# Altium schematic sheet external hvd schematic.SchDoc
size B; SheetNumber: 3; SheetTotal: 4
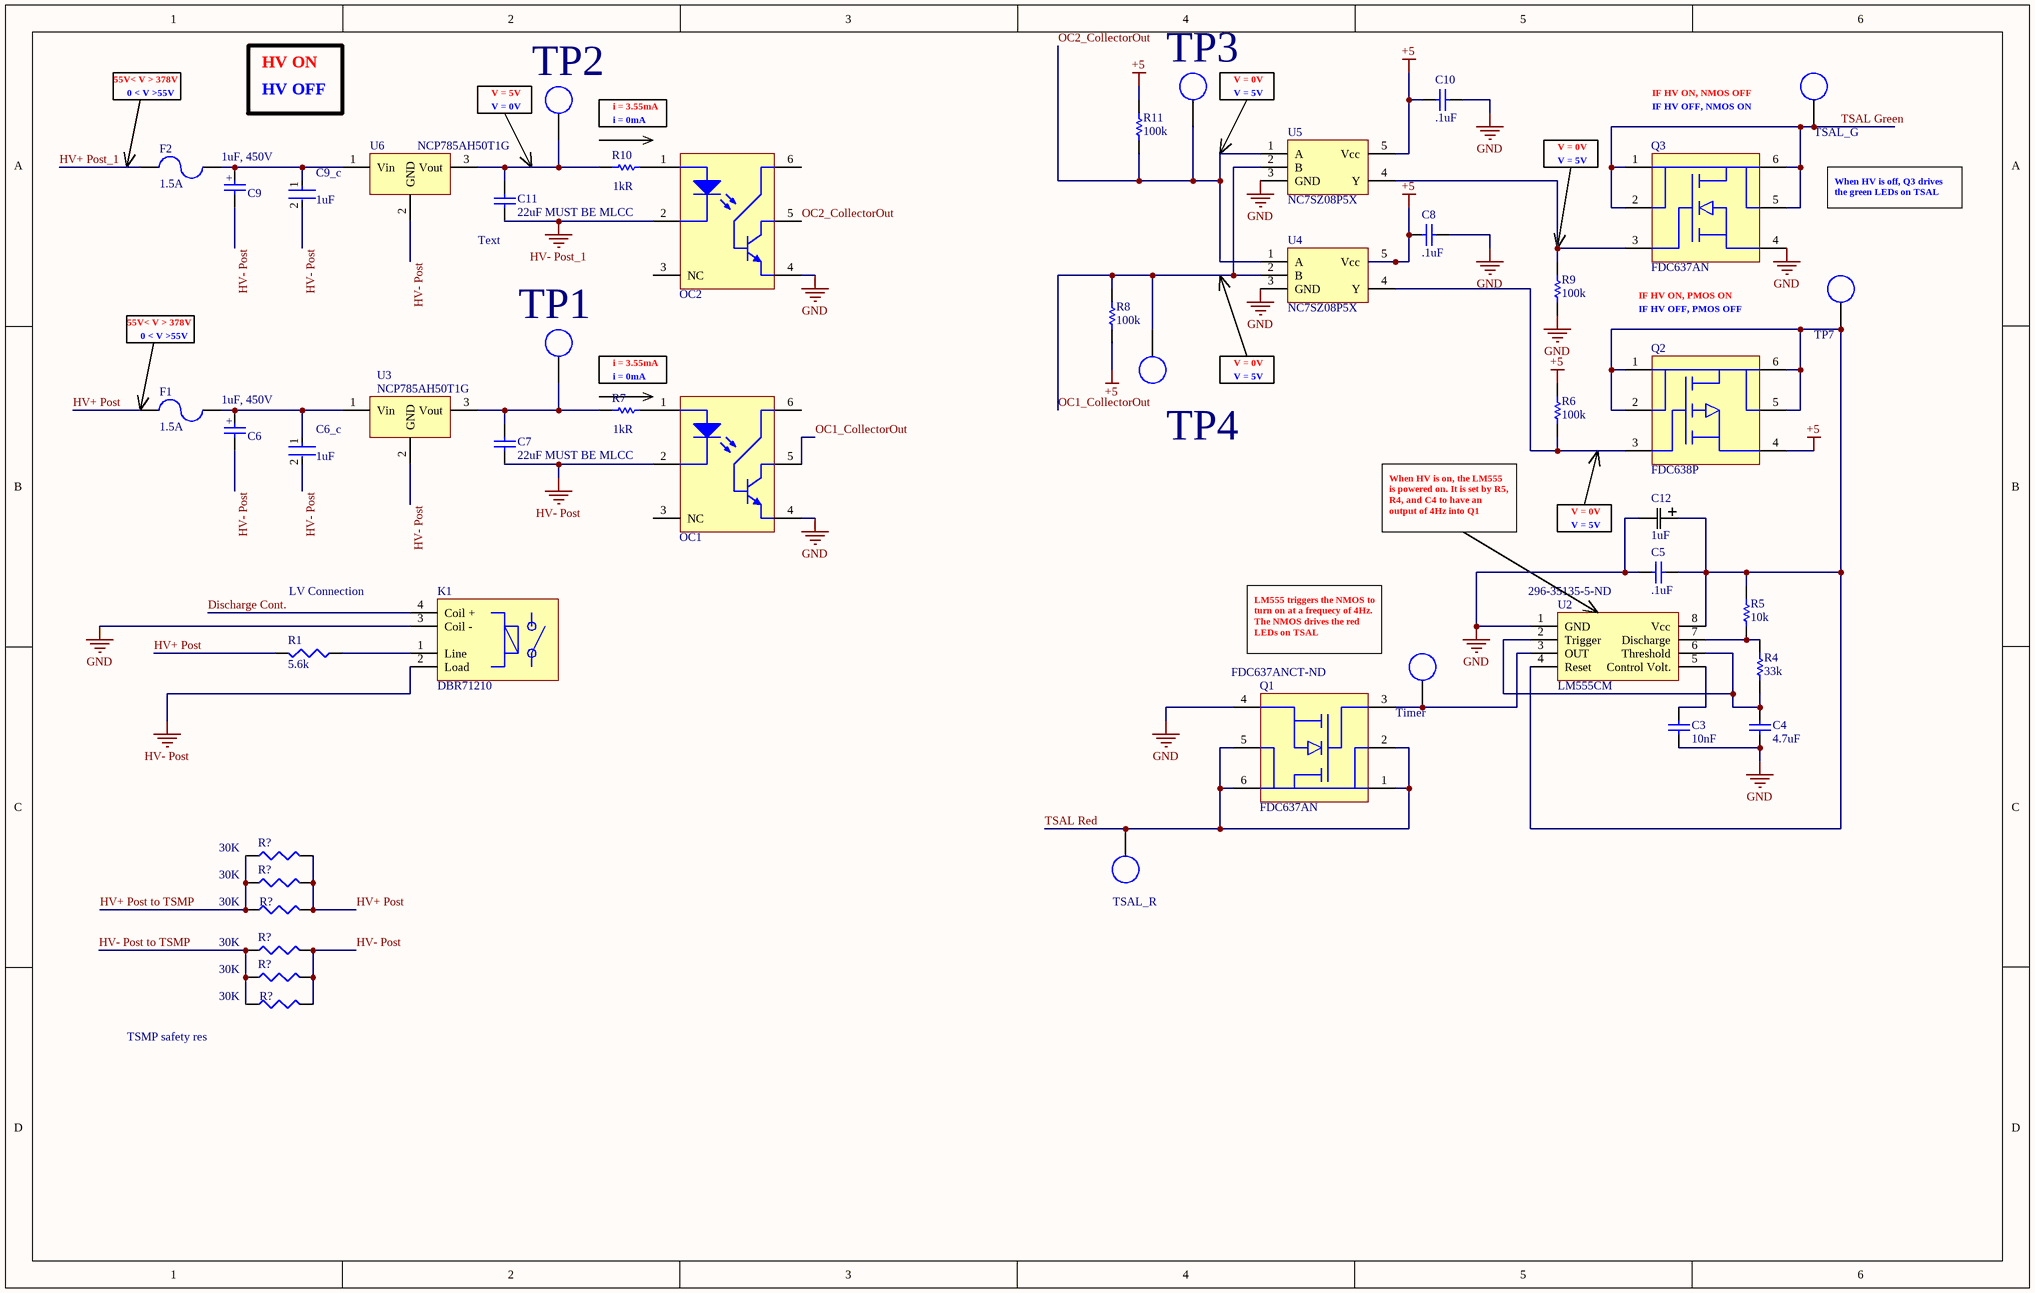
[diagram p0: external hvd schematic.SchDoc]

## Parts
(Parts that share a designator on the sheet are numbered #1, #2 ... from top to bottom, then left to right.)
C3  10nF  [CAPC2013X145X50LL20T25]
C4  4.7uF  [CAPC2013X145X50LL20T25]
C5  .1uF  [CAPC2013X145X50LL20T25]
C6  1uF, 450V  [Cap, TH, Electrolytic, 450V]
C6_c  Capacitance: 1uF  [FP-GRM55D-0_4-IPC_A]  (hidden comment: 2220Y5000105KXTWS2)
C7  22uF MUST BE MLCC  [CAPC2013X145X50LL20T25]
C8  .1uF  [CAPC2013X145X50LL20T25]
C9  1uF, 450V  [Cap, TH, Electrolytic, 450V]
C9_c  Capacitance: 1uF  [FP-GRM55D-0_4-IPC_A]  (hidden comment: 2220Y5000105KXTWS2)
C10  .1uF  [CAPC2013X145X50LL20T25]
C11  22uF MUST BE MLCC  [CAPC2013X145X50LL20T25]
C12  1uF  [CAP_J-V_4X5P5_RUB-L]
F1  1.5A  [048501.5DR]
F2  1.5A  [048501.5DR]
K1  DBR71210  [DBR71210]
OC1  CNY17-1  [DIP6]  (value not drawn)
OC2  CNY17-1  [DIP6]  (value not drawn)
Q1  FDC637AN  Supplier Part Number 1: FDC637ANCT-ND  [SSOT6]
Q2  FDC638P  [SSOT6]
Q3  FDC637AN  [SSOT6]
R1  5.6k  [25W Wirewound Resistor, Chassis Mount]
R4  33k  [RESC2013X50X30LL20T20]
R5  10k  [RESC2013X50X30LL20T20]
R6  100k  [RESC2013X50X30LL20T20]
R7  value 1kR  [RESC2013X70X40ML20T20]  (hidden comment: ERJ-6GEYJ102V)
R8  100k  [RESC2013X50X30LL20T20]
R9  100k  [RESC2013X50X30LL20T20]
R10  value 1kR  [RESC2013X70X40ML20T20]  (hidden comment: ERJ-6GEYJ102V)
R11  100k  [RESC2013X50X30LL20T20]
R?#1  30K  [5329]
R?#2  30K  [5329]
R?#3  30K  [5329]
R?#4  30K  [5329]
R?#5  30K  [5329]
R?#6  30K  [5329]
Timer  N/A  [PCB Test Point]  (value not drawn)
TP1  N/A  [PCB Test Point]  (value not drawn)
TP2  N/A  [PCB Test Point]  (value not drawn)
TP3  N/A  [PCB Test Point]  (value not drawn)
TP4  N/A  [PCB Test Point]  (value not drawn)
TP7  N/A  [PCB Test Point]  (value not drawn)
TSAL_G  N/A  [PCB Test Point]  (value not drawn)
TSAL_R  N/A  [PCB Test Point]  (value not drawn)
U2  LM555CM  Supplier Part Number 1: 296-35135-5-ND  [SOIC-8]
U3  NCP785AH50T1G  [SOT89]
U4  NC7SZ08P5X  [SOT23-5]
U5  NC7SZ08P5X  [SOT23-5]
U6  NCP785AH50T1G  [SOT89]

## Nets
+5: C8.2 C10.2 Q2.4 R6.1 R8.1 R11.1 U4.5(Vcc) U5.5(Vcc)
GND: C3.2 C4.2 C5.2 C8.1 C10.1 C12.2 K1.3(Coil_-) OC1.4 OC2.4 Q1.4 Q3.4 R9.2 U2.1(GND) U4.3(GND) U5.3(GND)
HV- Post: C6.2(Neg) C6_c.2 C7.2 C9.2(Neg) C9_c.2 K1.2(Load) OC1.2(C) R?#4.2 R?#5.2 R?#6.2 U3.2(GND) U6.2(GND)
HV- Post_1: C11.2 OC2.2(C)
Discharge Cont.: K1.4(Coil_+)
HV+ Post: F1.1 R1.2 R?#1.2 R?#2.2 R?#3.2
HV+ Post to TSMP: R?#1.1 R?#2.1 R?#3.1
HV+ Post_1: F2.1
HV- Post to TSMP: R?#4.1 R?#5.1 R?#6.1
OC1_CollectorOut: OC1.5 R8.2 TP4.1 U4.2(B) U5.2(B)
OC2_CollectorOut: OC2.5 R11.2 TP3.1 U4.1(A) U5.1(A)
TSAL Green: Q3.1 Q3.2 Q3.5 Q3.6 TSAL_G.1
TSAL Red: Q1.1 Q1.2 Q1.5 Q1.6 TSAL_R.1
NetC3_1: C3.1 U2.5(Control_Volt.)
NetC4_1: C4.1 R4.2 U2.2(Trigger) U2.6(Threshold)
NetC5_1: C5.1 C12.1 Q2.1 Q2.2 Q2.5 Q2.6 R5.1 TP7.1 U2.4(Reset) U2.8(Vcc)
NetC6_1: C6.1(Pos) C6_c.1 F1.2 U3.1(Vin)
NetC7_1: C7.1 R7.1 TP1.1 U3.3(Vout)
NetC9_1: C9.1(Pos) C9_c.1 F2.2 U6.1(Vin)
NetC11_1: C11.1 R10.1 TP2.1 U6.3(Vout)
NetK1_1: K1.1(Line) R1.1
NetOC1_1: OC1.1(A) R7.2
NetOC2_1: OC2.1(A) R10.2
NetQ1_3: Q1.3 Timer.1 U2.3(OUT)
NetQ2_3: Q2.3 R6.2 U4.4(Y)
NetQ3_3: Q3.3 R9.1 U5.4(Y)
NetR4_1: R4.1 R5.2 U2.7(Discharge)

Not connected (* = marked no-connect by the designer): OC1 3(NC) 6(Base); OC2 3(NC) 6(Base)

## Notes on the sheet
- 55V< V > 378V
- 0 < V >55V
- HV ON
- HV OFF
- (near TP2) V = 5V
- (near TP3) V = 0V
- V = 5V
- IF HV ON, NMOS OFF
- (near TP2) V = 0V
- i = 3.55mA
- i = 0mA
- V = 0V
- IF HV OFF, NMOS ON
- When HV is off, Q3 drives the green LEDs on TSAL
- (near C11) Text
- IF HV ON, PMOS ON
- IF HV OFF, PMOS OFF
- When HV is on, the LM555 is powered on. It is set by R5, R4, and C4 to have an output of 4Hz into Q1
- LV Connection
- LM555 triggers the NMOS to turn on at a frequecy of 4Hz. The NMOS drives the red LEDs on TSAL
- (near R?#6) TSMP safety res
- (in symbol Cap, TH Electrolytic 450V) +

## Library data of the parts
C3 = CMP-1036-04746-2: Generic SMD Cap, 0805 Package; Manufacturer 1: KEMET; Manufacturer Part Number 1: C0805C103F5GEC7800; Supplier 1: Digi-Key; Supplier Part Number 1: 399-C0805C103F5GEC7800CT-ND; RoHS: No; Category: Ceramic Capacitors; Stock 1: 7870; Pricing 1: 1=1.29000, 10=1.01700, 50=0.88180, 100=0.76310, 500=0.57656, 1000=0.50874 (USD)
C4 = CMP-1036-04746-2: Generic SMD Cap, 0805 Package; Manufacturer 1: TDK; Manufacturer Part Number 1: C2012X5R1E475K125AB; Dielectric Material: Ceramic; Voltage Rating: 25V; Tolerance: 10%; Dielectric: X5R; Supplier 1: Digi-Key; Supplier Part Number 1: 445-4116-1-ND; RoHS: Yes; Category: Ceramic Capacitors; Stock 1: 2458030; Pricing 1: 1=0.27000, 10=0.18200, 50=0.12120, 100=0.10300, 500=0.07272, 1000=0.06363 (USD); Mounting Technology: Surface Mount; Case/Package: 0805; Pins: 2; Case Code (Imperial): 0805; Case Code (Metric): 2012; Weight: 0.000194oz; Min Operating Temperature: -55°C; Max Operating Temperature: 85°C; Value: 4.7uF; Voltage Rating (DC): 25V; Packaging: Tape and Reel; Package Quantity: 2000; Termination: SMD/SMT; Resistor Type: Ceramic; Voltage: 25V; Series: C; Construction: Flat; Length: 2mm; Width: 1.25mm; Height: 1.25mm; Thickness: 0.057inch; Depth: 1.25mm; Radiation Hardening: No; Reach SVHC Compliant: Yes; Lead Free: Lead Free; RoHS Compliant: Yes; ComponentLink1URL: https://datasheet.ciiva.com/24216/tdkmlcccaprange-24216480.pdf?src-supplier=Mouser; ComponentLink1Description: https://datasheet.ciiva.com/24216/tdkmlcccaprange-24216480.pdf?src-supplier=Mouser; ComponentLink2URL: https://datasheet.ciiva.com/36857/1796654-36857301.pdf?src-supplier=Element14; ComponentLink2Description: https://datasheet.ciiva.com/36857/1796654-36857301.pdf?src-supplier=Element14; ComponentLink3URL: https://datasheet.ciiva.com/28602/1744655-28602173.pdf?src-supplier=Element14; ComponentLink3Description: https://datasheet.ciiva.com/28602/1744655-28602173.pdf?src-supplier=Element14; ComponentLink4URL: https://datasheet.ciiva.com/6251/tdkmlcccaprange-6251820.pdf?src-supplier=Digi-Key; ComponentLink4Description: https://datasheet.ciiva.com/6251/tdkmlcccaprange-6251820.pdf?src-supplier=Digi-Key; ComponentLink5URL: https://datasheet.ciiva.com/6251/tdkmlcccaprange-6251817.pdf?src-supplier=Digi-Key; ComponentLink5Description: https://datasheet.ciiva.com/6251/tdkmlcccaprange-6251817.pdf?src-supplier=Digi-Key; ComponentLink6URL: https://datasheet.ciiva.com/6251/tdkmlcccaprange-6251823.pdf?src-supplier=Digi-Key; ComponentLink6Description: https://datasheet.ciiva.com/6251/tdkmlcccaprange-6251823.pdf?src-supplier=Digi-Key; ComponentLink7URL: https://datasheet.ciiva.com/16449/e412-c-16449599.pdf?src-supplier=Future+Electronics; ComponentLink7Description: https://datasheet.ciiva.com/16449/e412-c-16449599.pdf?src-supplier=Future+Electronics
C5 C8 C10 = CMP-1036-04746-2: Generic SMD Cap, 0805 Package; Manufacturer: Kemet; Part Number: C0805C105K4PACTU; Manufacturer 1: Kyocera AVX; Manufacturer Part Number 1: 08055C104KAT4A; Dielectric Material: Ceramic; Voltage Rating (DC): 50V; Value: 100nF; Tolerance: 10%; Dielectric: X7R; Dissipation Factor: 2.5%; Supplier 1: Digi-Key; Supplier Part Number 1: 478-10836-1-ND; RoHS: Yes; Category: Ceramic Capacitors; Stock 1: 791232; Pricing 1: 1=0.10000, 10=0.06700, 50=0.03640, 100=0.02970, 500=0.02120, 1000=0.01666, 2500=0.01515, 5000=0.01394 (USD); Mounting Technology: Surface Mount; Case/Package: 0805; Pins: 2; Case Code (Imperial): 0805; Case Code (Metric): 2012; Min Operating Temperature: -55°C; Max Operating Temperature: 125°C; Packaging: Tape and Reel; Voltage Rating: 50V; Package Quantity: 15000; Termination: SMD/SMT; Voltage: 50V; Construction: Flat; Length: 2.01mm; Width: 1.25mm; Height: 0.94mm; Depth: 1.25mm; Radiation Hardening: No; Reach SVHC Compliant: Yes; Lead Free: Lead Free; RoHS Compliant: Yes; ComponentLink1URL: https://datasheet.ciiva.com/2988/cx7r-2988015.pdf?src-supplier=Avnet; ComponentLink1Description: https://datasheet.ciiva.com/2988/cx7r-2988015.pdf?src-supplier=Avnet; ComponentLink2URL: https://datasheet.ciiva.com/2988/cx7r-2988016.pdf?src-supplier=Avnet; ComponentLink2Description: https://datasheet.ciiva.com/2988/cx7r-2988016.pdf?src-supplier=Avnet; ComponentLink3URL: https://datasheet.ciiva.com/5423/cx7r-218113-5423437.pdf?src-supplier=Mouser; ComponentLink3Description: https://datasheet.ciiva.com/5423/cx7r-218113-5423437.pdf?src-supplier=Mouser; ComponentLink4URL: https://datasheet.ciiva.com/16222/cx7r-16222253.pdf?src-supplier=Future+Electronics; ComponentLink4Description: https://datasheet.ciiva.com/16222/cx7r-16222253.pdf?src-supplier=Future+Electronics; ComponentLink5URL: https://datasheet.ciiva.com/22676/1679506-22676605.pdf?src-supplier=Element14; ComponentLink5Description: https://datasheet.ciiva.com/22676/1679506-22676605.pdf?src-supplier=Element14; ComponentLink6URL: https://datasheet.ciiva.com/28613/1679506-28613114.pdf?src-supplier=Element14; ComponentLink6Description: https://datasheet.ciiva.com/28613/1679506-28613114.pdf?src-supplier=Element14
C6 C9 = Cap, TH Electrolytic 450V: 8mmx3.5mm; Supplier 1: Digi-Key; Supplier Part Number 1: 493-13563-1-ND
C6_c C9_c = CMP-2000-06370-2: 1 µF ±10% 500V Ceramic Capacitor X7R 2220 (5750 Metric); Voltage Rating (DC): 250V; Width: 5mm; Height: 2mm; Case Code (Imperial): 2220; Max Operating Temperature: 125°C; Number of Pins: 2; Min Operating Temperature: -55°C; Termination: SMD/SMT; Case/Package: 2220; Dielectric: X7R; Material: Ceramic; REACH SVHC: No SVHC; Voltage: 250V; Packaging: Tape and Reel; Thickness: 0.087inch; Depth: 5mm; Package Quantity: 1; Tolerance: 10%; Mount: Surface Mount; Voltage Rating: 250V; Length: 5.7mm; Case Code (Metric): 5750; Lead Free: Lead Free
C7 C11 = CMP-1036-04746-2: Generic SMD Cap, 0805 Package; Manufacturer: Kemet; Part Number: C0805C105K4PACTU
C12 = 35SZV1M4X5.5: CAP ALUM 1UF 20% 50V SMD; Mfr_Name: Rubycon; Manufacturer Part Number 1: 50SEV1M4X5.5; Ripple Current: 8.4mA; Polarity: Polar; Life (Hours): 2000Hour; Q Factor: 0.12; Supplier 1: Digi-Key; Supplier Part Number 1: 1189-2464-1-ND; Manufacturer 1: Rubycon; RoHS: Yes; Category: Aluminum Electrolytic Capacitors; Stock 1: 6420; Pricing 1: 1=0.53000, 10=0.36700, 50=0.25680, 100=0.22010, 500=0.16508, 1000=0.13940 (USD); Mounting Technology: Surface Mount; Case/Package: Radial; Min Operating Temperature: -40°C; Max Operating Temperature: 85°C; Voltage Rating: 50V; Value: 1uF; Tolerance: 20%; Packaging: Tape and Reel; Package Quantity: 1; Voltage: 50V; Series: SEV; Construction: Cylindrical; Height - Seated (Max): 0.217inch; Radiation Hardening: No; Lead Free: Lead Free; RoHS Compliant: Yes; ComponentLink1URL: https://datasheet.ciiva.com/14116/sasev-data-e-14116112.pdf?src-supplier=Distrelec; ComponentLink1Description: https://datasheet.ciiva.com/14116/sasev-data-e-14116112.pdf?src-supplier=Distrelec; ComponentLink2URL: https://datasheet.ciiva.com/41805/sev-series-41805573.pdf?src-supplier=Digi-Key; ComponentLink2Description: https://datasheet.ciiva.com/41805/sev-series-41805573.pdf?src-supplier=Digi-Key
F1 F2 = 048501.5DR: 1.5A 600VDC Fuse, SMD Mount; Manufactuer: Littlefuse; TargetLibrary: RITRacing-Passives; Value: Value?; Publisher: T.Tallo; Published: 22Oct2016; Status: Active; Datasheet: https://www.littelfuse.com/~/media/electronics/datasheets/fuses/littelfuse_fuse_485_datasheet.pdf.pdf; Part Number: 048501.5DR; Supplier 1: Digi-Key; Supplier Part Number 1: F5922CT-ND
K1 = DBR71210: SPST, NC Reed Relay, 1000V, 3A, TH; Manufacturer: Cynergy 3; TargetLibrary: RITRacing-Relays_Switches; PartNumber: DBR71210; Publisher: T.Tallo; Published: 20Oct2016; Status: Active; ComponentLink1URL: https://www.cynergy3.com/sites/default/files/D%20series%202016_5.pdf; ComponentLink1Description: Datasheet; Supplier: Digikey; Supplier Part Number: 725-1049-ND
OC1 OC2 = CNY17-1: Optocoupler DC-IN 1-CH Transistor With Base DC-OUT 6-Pin PDIP Tube; Manufacturer: Vishay; TargetLibrary: RITRacing-Transistors; Number of Channels: 1; Collector Emitter Voltage (VCEO): 250mV; Output Current per Channel: 100mA; Isolation Voltage: 5kV; Max Power Dissipation: 150mW; Forward Voltage: 1.65V; Output Voltage: 70V; Collector Emitter Saturation Voltage: 400mV; Max Input Current: 60mA; Current Transfer Ratio: -80%; Rise Time: 2us; Input Type: DC; Reverse Breakdown Voltage: 5V; Fall Time: 11us; Voltage Rating (DC): 32V; Value: 25pF; Approvals: VDE; PartNumber: CNY17-1; Publisher: T.Tallo; Published: 24Dec2016; Status: Active; Supplier 1: Digi-Key; Supplier Part Number 1: CNY17-1.-ND; Manufacturer 1: Vishay; Manufacturer Part Number 1: CNY17-1; RoHS: Yes; Category: Optocouplers; Stock 1: 1397; Pricing 1: 1=0.66000, 10=0.43200, 100=0.28570, 1000=0.22056, 2000=0.19931, 5000=0.18602, 10000=0.17937, 25000=0.17672 (USD); Mounting Technology: Through Hole; Case/Package: DIP; Pins: 6; Min Operating Temperature: -55°C; Max Operating Temperature: 100°C; Packaging: Rail/Tube; Package Quantity: 2000; Max Output Voltage: 70V; Forward Current: 60mA; Collector-emitter Voltage-Max: 400mV; Max Collector Current: 100mA; Number of Elements: 1; Power Dissipation: 150mW; Input Current: 60mA; Collector Emitter Breakdown Voltage: 70V; Isolation Voltage-Max: 5kV; Radiation Hardening: No; Lead Free: Lead Free; RoHS Compliant: Yes; ComponentLink2URL: https://datasheet.ciiva.com/15118/getdatasheetpartid-74706-15118480.pdf?src-supplier=Verical; ComponentLink3URL: https://datasheet.ciiva.com/14146/cny17-eng-tds-14146953.pdf?src-supplier=Distrelec; ComponentLink3Description: https://datasheet.ciiva.com/14146/cny17-eng-tds-14146953.pdf?src-supplier=Distrelec; ComponentLink4URL: https://datasheet.ciiva.com/4111/29592200s462310n5680-4111008.pdf?src-supplier=Arrow+Electronics; ComponentLink4Description: https://datasheet.ciiva.com/4111/29592200s462310n5680-4111008.pdf?src-supplier=Arrow+Electronics; ComponentLink5URL: https://datasheet.ciiva.com/29301/153371-da-01-en-optocoupler-cny17-1-29301381.pdf?src-supplier=Conrad; ComponentLink5Description: https://datasheet.ciiva.com/29301/153371-da-01-en-optocoupler-cny17-1-29301381.pdf?src-supplier=Conrad; ComponentLink6URL: https://datasheet.ciiva.com/8085/cny17-8085017.pdf?src-supplier=Avnet; ComponentLink6Description: https://datasheet.ciiva.com/8085/cny17-8085017.pdf?src-supplier=Avnet; ComponentLink7URL: https://datasheet.ciiva.com/2086/s-110-cny17-2086327.pdf?src-supplier=Digi-Key; ComponentLink7Description: https://datasheet.ciiva.com/2086/s-110-cny17-2086327.pdf?src-supplier=Digi-Key; ComponentLink8URL: https://datasheet.ciiva.com/16429/cny17-16429671.pdf?src-supplier=Future+Electronics; ComponentLink8Description: https://datasheet.ciiva.com/16429/cny17-16429671.pdf?src-supplier=Future+Electronics
  OC1: ComponentLink1URL: http://www.mouser.com/ds/2/427/sfh618a-241330.pdf; ComponentLink1Description: Datasheet; ComponentLink2Description: https://datasheet.ciiva.com/15118/getdatasheetpartid-74706-15118480.pdf?src-supplier=Verical
  OC2: ComponentLink2Description: Datasheet
Q1 Q3 = FDC637AN: N Channel FET, SMT, 6.2A, 20V; Manufacturer: On Semi; TargetLibrary: RITRacing-Transistors; PartNumber: FDC637AN; Publisher: T.Tallo; Published: 09/27/2017; Status: Active; ComponentLink1Description: Datasheet; ComponentLink1URL: https://www.mouser.com/datasheet/2/308/FDS4465-1297512.pdf; Supplier 1: Digi-Key
  Q3: Supplier Part Number 1: FDC637ANCT-ND
Q2 = FDC638P: P Channel FET, SMT, 4.5A, 20V; Manufacturer: On Semi; TargetLibrary: RITRacing-Transistors; PartNumber: FDC638P; Publisher: T.Tallo; Published: 09/27/2017; Status: Active; ComponentLink1Description: Datasheet; ComponentLink1URL: https://www.mouser.com/datasheet/2/308/FDS4465-1297512.pdf; Supplier 1: Digi-Key; Supplier Part Number 1: FDC638PCT-ND
R1 = HSA251K0J: Res Wirewound 5.6K Ohm 5% 25W ±30ppm/C Aluminum Housed AXL Flange Mount Loose/Tray; Manufacturer 1: TE Connectivity; Manufacturer Part Number 1: HSA255K6J; TargetLibrary: RITRacing-Passives; Value: Value?; Temperature Coefficient: 30ppm/°C; Lead/Base Style: Fixed; Voltage Rating: 550V; Number of Resistors: 1; Publisher: T.Tallo; Published: 22Oct2016; Status: Active; Supplier 1: Digi-Key; Supplier Part Number 1: A102146-ND; RoHS: Yes; Category: Wirewound Resistors; Stock 1: 604; Pricing 1: 1=4.14000, 10=3.73800, 25=3.41960, 50=3.18100, 100=2.78340, 250=2.38572, 500=2.18692, 1000=2.00401, 5000=1.96842 (USD); Mounting Technology: Chassis Mount; Housing Material: Aluminium; Min Operating Temperature: -55°C; Max Operating Temperature: 200°C; Tolerance: 5%; Power Rating: 25W; Resistor Type: Wirewound,Power resistor; Packaging: Tray; Package Quantity: 100; Termination: Solder; Series: HS, CGS; Max Power Dissipation: 25W; Voltage Rating (DC): 550V; Number of Terminations: 2; Voltage Rating (AC): 550V; Technology: WIRE WOUND; Resistance Tolerance: 5%; Length: 29mm; Width: 28mm; Height: 15mm; RoHS Compliant: Yes; Reach SVHC Compliant: Yes; ELV: Compliant; ComponentLink1URL: https://datasheet.ciiva.com/11805/0900766b80ef190c-11805908.pdf?src-supplier=Rs; ComponentLink1Description: https://datasheet.ciiva.com/11805/0900766b80ef190c-11805908.pdf?src-supplier=Rs; ComponentLink2URL: https://datasheet.ciiva.com/7716/1498243-7716135.pdf?src-supplier=Element14; ComponentLink2Description: https://datasheet.ciiva.com/7716/1498243-7716135.pdf?src-supplier=Element14; ComponentLink3URL: https://datasheet.ciiva.com/12694/eng-ds-1773035-c-12694949.pdf?src-supplier=Mouser; ComponentLink3Description: https://datasheet.ciiva.com/12694/eng-ds-1773035-c-12694949.pdf?src-supplier=Mouser
R4 = CMP-2001-04896-1: Manufacturer: Vishay Dale; Part Number: CRCW08050000Z0EA; Manufacturer 1: Panasonic; Manufacturer Part Number 1: ERA-6AEB333V; Value: 33kR; Power Rating: 125mW; Tolerance: 0.1%; Temperature Coefficient: 25ppm/°C; Voltage Rating: 100V; Supplier 1: Digi-Key; Supplier Part Number 1: P33KDACT-ND; RoHS: Yes; Category: Chip SMD Resistors; Stock 1: 160000; Pricing 1: 1=0.36000, 10=0.30100, 100=0.11770, 500=0.07116, 1000=0.04927, 2500=0.04516 (USD); Mounting Technology: Surface Mount; Case/Package: 0805; Pins: 2; Case Code (Metric): 2012; Case Code (Imperial): 0805; Contact Plating: Tin; Min Operating Temperature: -55°C; Max Operating Temperature: 155°C; Packaging: Tape and Reel; Resistor Type: Thin Film; Termination: SMD/SMT; Series: ERA-6A; Voltage Rating (DC): 100V; Package Quantity: 1; Number of Terminations: 2; Max Power Dissipation: 125mW; Resistance Tolerance: 0.1%; Features: Automotive AEC-Q200; Construction: Rectangular; Technology: METAL FILM; Length: 2mm; Width: 1.25mm; Height: 0.5mm; Depth: 1.25mm; Ratings: AEC-Q200; Radiation Hardening: No; RoHS Compliant: Yes; Lead Free: Lead Free; Military Standard: Not; Reach SVHC Compliant: Yes; ComponentLink1URL: https://datasheet.ciiva.com/11813/0900766b80beefcc-11813136.pdf?src-supplier=Rs; ComponentLink1Description: https://datasheet.ciiva.com/11813/0900766b80beefcc-11813136.pdf?src-supplier=Rs; ComponentLink2URL: https://datasheet.ciiva.com/26335/453496-da-01-en-widerstand-0805-era-26335713.pdf?src-supplier=Conrad; ComponentLink2Description: https://datasheet.ciiva.com/26335/453496-da-01-en-widerstand-0805-era-26335713.pdf?src-supplier=Conrad; ComponentLink3URL: https://datasheet.ciiva.com/43455/485442-43455275.pdf?src-supplier=Farnell; ComponentLink3Description: https://datasheet.ciiva.com/43455/485442-43455275.pdf?src-supplier=Farnell; ComponentLink4URL: https://datasheet.ciiva.com/46397/485442-46397061.pdf?src-supplier=Element14; ComponentLink4Description: https://datasheet.ciiva.com/46397/485442-46397061.pdf?src-supplier=Element14; ComponentLink5URL: https://datasheet.ciiva.com/48530/era-eng-tds-48530172.pdf?src-supplier=Distrelec; ComponentLink5Description: https://datasheet.ciiva.com/48530/era-eng-tds-48530172.pdf?src-supplier=Distrelec; ComponentLink6URL: https://datasheet.ciiva.com/43457/485442-43457817.pdf?src-supplier=Farnell; ComponentLink6Description: https://datasheet.ciiva.com/43457/485442-43457817.pdf?src-supplier=Farnell; ComponentLink7URL: https://datasheet.ciiva.com/46436/485442-46436607.pdf?src-supplier=Element14; ComponentLink7Description: https://datasheet.ciiva.com/46436/485442-46436607.pdf?src-supplier=Element14; ComponentLink8URL: https://datasheet.ciiva.com/24068/aoa0000ce26-197354-24068904.pdf?src-supplier=Mouser; ComponentLink8Description: https://datasheet.ciiva.com/24068/aoa0000ce26-197354-24068904.pdf?src-supplier=Mouser; ComponentLink9URL: https://datasheet.ciiva.com/9190/aoa0000ce26-9190636.pdf?src-supplier=Avnet; ComponentLink9Description: https://datasheet.ciiva.com/9190/aoa0000ce26-9190636.pdf?src-supplier=Avnet; ComponentLink10URL: https://datasheet.ciiva.com/30187/54aoa0000ce26-30187628.pdf?src-supplier=Onlinecomponents.com; ComponentLink10Description: https://datasheet.ciiva.com/30187/54aoa0000ce26-30187628.pdf?src-supplier=Onlinecomponents.com
R5 = CMP-2001-04896-1: Manufacturer: Vishay Dale; Part Number: CRCW08050000Z0EA; Manufacturer 1: Panasonic; Manufacturer Part Number 1: ERJ-6GEYJ103V; Value: 10kR; Tolerance: 5%; Power Rating: 125mW; Voltage Rating: 150V; Temperature Coefficient: 200ppm/°C; Supplier 1: Digi-Key; Supplier Part Number 1: P10KACT-ND; RoHS: Yes; Category: Chip SMD Resistors; Stock 1: 2932917; Pricing 1: 1=0.10000, 10=0.06800, 100=0.02780, 1000=0.01251, 2500=0.01086 (USD); Mounting Technology: Surface Mount; Case/Package: 0805; Case Code (Metric): 2012; Case Code (Imperial): 0805; Contact Plating: Tin; Min Operating Temperature: -55°C; Max Operating Temperature: 155°C; Packaging: Tape and Reel; Resistor Type: Thick Film; Number of Terminations: 2; Termination: SMD/SMT; Max Power Dissipation: 125mW; Series: ERJ; Resistance Tolerance: 5%; Voltage Rating (DC): 150V; Package Quantity: 5000; Technology: THICK FILM; Construction: Rectangular; Features: Automotive AEC-Q200; Length: 2mm; Width: 1.25mm; Height: 0.6mm; Depth: 1.25mm; Radiation Hardening: No; RoHS Compliant: Yes; Military Standard: Not; Lead Free: Lead Free; Reach SVHC Compliant: Yes; ComponentLink1URL: https://datasheet.ciiva.com/11821/0900766b80f806dd-11821504.pdf?src-supplier=Rs; ComponentLink1Description: https://datasheet.ciiva.com/11821/0900766b80f806dd-11821504.pdf?src-supplier=Rs; ComponentLink2URL: https://datasheet.ciiva.com/16782/70255313-16782712.pdf?src-supplier=Allied+Electronics; ComponentLink2Description: https://datasheet.ciiva.com/16782/70255313-16782712.pdf?src-supplier=Allied+Electronics; ComponentLink3URL: https://datasheet.ciiva.com/9117/aoa0000ce1-9117371.pdf?src-supplier=Avnet; ComponentLink3Description: https://datasheet.ciiva.com/9117/aoa0000ce1-9117371.pdf?src-supplier=Avnet; ComponentLink4URL: https://datasheet.ciiva.com/16428/aoa0000ce1-16428072.pdf?src-supplier=Future+Electronics; ComponentLink4Description: https://datasheet.ciiva.com/16428/aoa0000ce1-16428072.pdf?src-supplier=Future+Electronics; ComponentLink5URL: https://datasheet.ciiva.com/30128/4aoa0000ce1-30128839.pdf?src-supplier=Onlinecomponents.com; ComponentLink5Description: https://datasheet.ciiva.com/30128/4aoa0000ce1-30128839.pdf?src-supplier=Onlinecomponents.com; ComponentLink6URL: https://datasheet.ciiva.com/43460/1500035-43460125.pdf?src-supplier=Farnell; ComponentLink6Description: https://datasheet.ciiva.com/43460/1500035-43460125.pdf?src-supplier=Farnell; ComponentLink7URL: https://datasheet.ciiva.com/46386/1500035-46386469.pdf?src-supplier=Element14; ComponentLink7Description: https://datasheet.ciiva.com/46386/1500035-46386469.pdf?src-supplier=Element14; ComponentLink8URL: https://datasheet.ciiva.com/22785/1500035-22785957.pdf?src-supplier=Farnell; ComponentLink8Description: https://datasheet.ciiva.com/22785/1500035-22785957.pdf?src-supplier=Farnell; ComponentLink9URL: https://datasheet.ciiva.com/28514/1678796-28514236.pdf?src-supplier=Element14; ComponentLink9Description: https://datasheet.ciiva.com/28514/1678796-28514236.pdf?src-supplier=Element14; ComponentLink10URL: https://datasheet.ciiva.com/16787/70255313-16787775.pdf?src-supplier=Allied+Electronics; ComponentLink10Description: https://datasheet.ciiva.com/16787/70255313-16787775.pdf?src-supplier=Allied+Electronics
R6 R8 R9 R11 = CMP-2001-04896-1: Manufacturer: Vishay Dale; Part Number: CRCW08050000Z0EA
R7 R10 = CMP-2001-00336-1: Manufacturer: Panasonic; Tolerance: 5%; Power Rating: 125mW; Voltage Rating: 150V; Temperature Coefficient: 200ppm/°C; Part Number: ERJ-6GEYJ102V; Supplier 1: Digi-Key; Supplier Part Number 1: P1.0KADKR-ND; Manufacturer 1: Panasonic; Manufacturer Part Number 1: ERJ-6GEYJ102V; RoHS: Yes; Category: Chip SMD Resistors; Stock 1: 741929; Pricing 1: 1=0.10000, 10=0.06800, 100=0.02780, 1000=0.01251, 2500=0.01086 (USD); Mounting Technology: Surface Mount; Case/Package: 0805; Case Code (Imperial): 0805; Case Code (Metric): 2012; Contact Plating: Tin; Min Operating Temperature: -55°C; Max Operating Temperature: 155°C; Packaging: Tape and Reel; Resistor Type: Thick Film; Number of Terminations: 2; Termination: SMD/SMT; Max Power Dissipation: 125mW; Series: ERJ; Resistance Tolerance: 5%; Package Quantity: 1; Voltage Rating (DC): 150V; Construction: Rectangular; Technology: THICK FILM; Length: 2mm; Width: 1.25mm; Height: 0.6mm; Depth: 1.25mm; Radiation Hardening: No; RoHS Compliant: Yes; Military Standard: Not; Lead Free: Lead Free; Reach SVHC Compliant: Yes; ComponentLink1URL: https://datasheet.ciiva.com/11808/0900766b80f806dd-11808499.pdf?src-supplier=Rs; ComponentLink1Description: https://datasheet.ciiva.com/11808/0900766b80f806dd-11808499.pdf?src-supplier=Rs; ComponentLink2URL: https://datasheet.ciiva.com/43460/1500035-43460108.pdf?src-supplier=Farnell; ComponentLink2Description: https://datasheet.ciiva.com/43460/1500035-43460108.pdf?src-supplier=Farnell; ComponentLink3URL: https://datasheet.ciiva.com/46386/1500035-46386460.pdf?src-supplier=Element14; ComponentLink3Description: https://datasheet.ciiva.com/46386/1500035-46386460.pdf?src-supplier=Element14; ComponentLink4URL: https://datasheet.ciiva.com/46371/1500035-46371933.pdf?src-supplier=Element14; ComponentLink4Description: https://datasheet.ciiva.com/46371/1500035-46371933.pdf?src-supplier=Element14; ComponentLink5URL: https://datasheet.ciiva.com/28532/1500035-28532142.pdf?src-supplier=Element14; ComponentLink5Description: https://datasheet.ciiva.com/28532/1500035-28532142.pdf?src-supplier=Element14; ComponentLink6URL: https://datasheet.ciiva.com/24026/aoa0000ce1-37422-24026920.pdf?src-supplier=Mouser; ComponentLink6Description: https://datasheet.ciiva.com/24026/aoa0000ce1-37422-24026920.pdf?src-supplier=Mouser; ComponentLink7URL: https://datasheet.ciiva.com/16788/70255313-16788493.pdf?src-supplier=Allied+Electronics; ComponentLink7Description: https://datasheet.ciiva.com/16788/70255313-16788493.pdf?src-supplier=Allied+Electronics; ComponentLink8URL: https://datasheet.ciiva.com/9117/aoa0000ce1-9117367.pdf?src-supplier=Avnet; ComponentLink8Description: https://datasheet.ciiva.com/9117/aoa0000ce1-9117367.pdf?src-supplier=Avnet; ComponentLink9URL: https://datasheet.ciiva.com/48532/aoa0000ce1-48532157.pdf?src-supplier=Avnet; ComponentLink9Description: https://datasheet.ciiva.com/48532/aoa0000ce1-48532157.pdf?src-supplier=Avnet; ComponentLink10URL: https://datasheet.ciiva.com/30074/4aoa0000ce1-30074261.pdf?src-supplier=Onlinecomponents.com; ComponentLink10Description: https://datasheet.ciiva.com/30074/4aoa0000ce1-30074261.pdf?src-supplier=Onlinecomponents.com
R?#1-R?#6 = SMF530KJT: Res Metal Film 30K Ohm 5% 5W ±100ppm/°C Molded J-Lead SMD T/R; Manufacturer 1: TE Connectivity Holsworthy; TargetLibrary: RITRacing-Passives; MFG: TE Connectivity; Voltage Rating: 500V; Number of Resistors: 1; Publisher: T.Tallo; Published: 22Oct2016; Status: Active; Value: 30K; Datasheet: https://www.mouser.com/datasheet/2/418/5/ENG_DS_1773242_F-732267.pdf; Supplier 1: Digi-Key; Supplier Part Number 1: A138700CT-ND; Manufacturer Part Number 1: SMF530KJT; RoHS: Yes; Category: Chip SMD Resistors; Stock 1: 804; Pricing 1: 1=1.10000, 10=0.97100, 25=0.89280, 50=0.81460, 100=0.70500, 250=0.59532 (USD); Mounting Technology: Surface Mount; Case/Package: SMD/SMT; Min Operating Temperature: -80°C; Max Operating Temperature: 280°C; Power Rating: 5W; Tolerance: 5%; Resistor Type: Power resistor; Packaging: Tape and Reel; Temperature Coefficient: 100ppm/°C; Voltage Rating (DC): 500V; Number of Terminations: 2; Resistance Tolerance: 5%; Features: Flame Retardant Coating; Series: SMF, CGS; Max Power Dissipation: 5W; Termination: Solder; Technology: METAL FILM; Length: 13.5mm; Height: 6.8mm; Depth: 7.3mm; Reach SVHC Compliant: Yes; RoHS Compliant: Yes; ELV: Compliant; ComponentLink1URL: http://www.farnell.com/datasheets/1572268.pdf?src-supplier=Farnell; ComponentLink1Description: http://www.farnell.com/datasheets/1572268.pdf?src-supplier=Farnell; ComponentLink2URL: http://www.mouser.com/ds/2/418/NG_DS_1773242_E-732267.pdf?src-supplier=Mouser; ComponentLink2Description: http://www.mouser.com/ds/2/418/NG_DS_1773242_E-732267.pdf?src-supplier=Mouser; ComponentLink3URL: http://uk.rs-online.com/webdocs/12d5/0900766b812d5acc.pdf?src-supplier=Rs; ComponentLink3Description: http://uk.rs-online.com/webdocs/12d5/0900766b812d5acc.pdf?src-supplier=Rs; ComponentLink4URL: http://www.farnell.com/datasheets/1572268.pdf?src-supplier=Element14; ComponentLink4Description: http://www.farnell.com/datasheets/1572268.pdf?src-supplier=Element14; ComponentLink5URL: https://www.te.com/commerce/DocumentDelivery/DDEController?Action=srchrtrv&amp;DocNm=1773242&amp;DocType=DS&amp;DocLang=English&src-supplier=Digi-Key; ComponentLink5Description: https://www.te.com/commerce/DocumentDelivery/DDEController?Action=srchrtrv&amp;DocNm=1773242&amp;DocType=DS&amp;DocLang=English&src-supplier=Digi-Key
Timer TP1-TP4 TP7 TSAL_G TSAL_R = PCB Test Point: Manufacturer: RIT Racing; TargetLibrary: RITRacing-Connectors; PartNumber: N/A; Publisher: T.Tallo; Published: 22Oct2016; Status: Active; ComponentLink1URL: http://www.mouser.com/ds/2/215/005-5009-743680.pdf; ComponentLink1Description: Datasheet
U2 = LM555CM: 555 Timer; Manufacturer: Texas Instruments; TargetLibrary: RITRacing-ICs; PartNumber: LM555CM; Publisher: T.Tallo; Published: 27Oct2016; Status: Active; ComponentLink1URL: http://www.ti.com/lit/ds/symlink/lm393-n.pdf; ComponentLink1Description: Datasheet; Supplier 1: Digi-Key
U3 U6 = NCP785AH50T1G: Linear Reg. 55V-450V IN, 5V OUT; Manufacturer: On Semi; TargetLibrary: RITRacing-ICs; PartNumber: NCP785AH50T1G; Publisher: T.Tallo; Published: 27Oct2016; Status: Active; ComponentLink1URL: http://www.mouser.com/ds/2/268/20005399A-909415.pdf; ComponentLink1Description: Datasheet; Supplier 1: Newark; Supplier Part Number 1: 50AC6348; Supplier 2: Digi-Key; Supplier Part Number 2: NCP785AH50T1GOSDKR-ND
U4 U5 = NC7SZ08P5X: Single, 2 Input AND Gate, SMD; Manufacturer: ON Semi; TargetLibrary: RITRacing-ICs; PartNumber: NC7SZ08P5X; Publisher: T.Tallo; Published: 20Oct2016; Status: Active; ComponentLink1URL: http://www.ti.com/lit/ds/symlink/cd4081b.pdf; ComponentLink1Description: Datasheet; Supplier 1: Digi-Key; Supplier Part Number 1: NC7SZ08P5XCT-ND